# EAGLE schematic DrinkbotPCB (EAGLE 6.1)

## Sheet 1 of 2
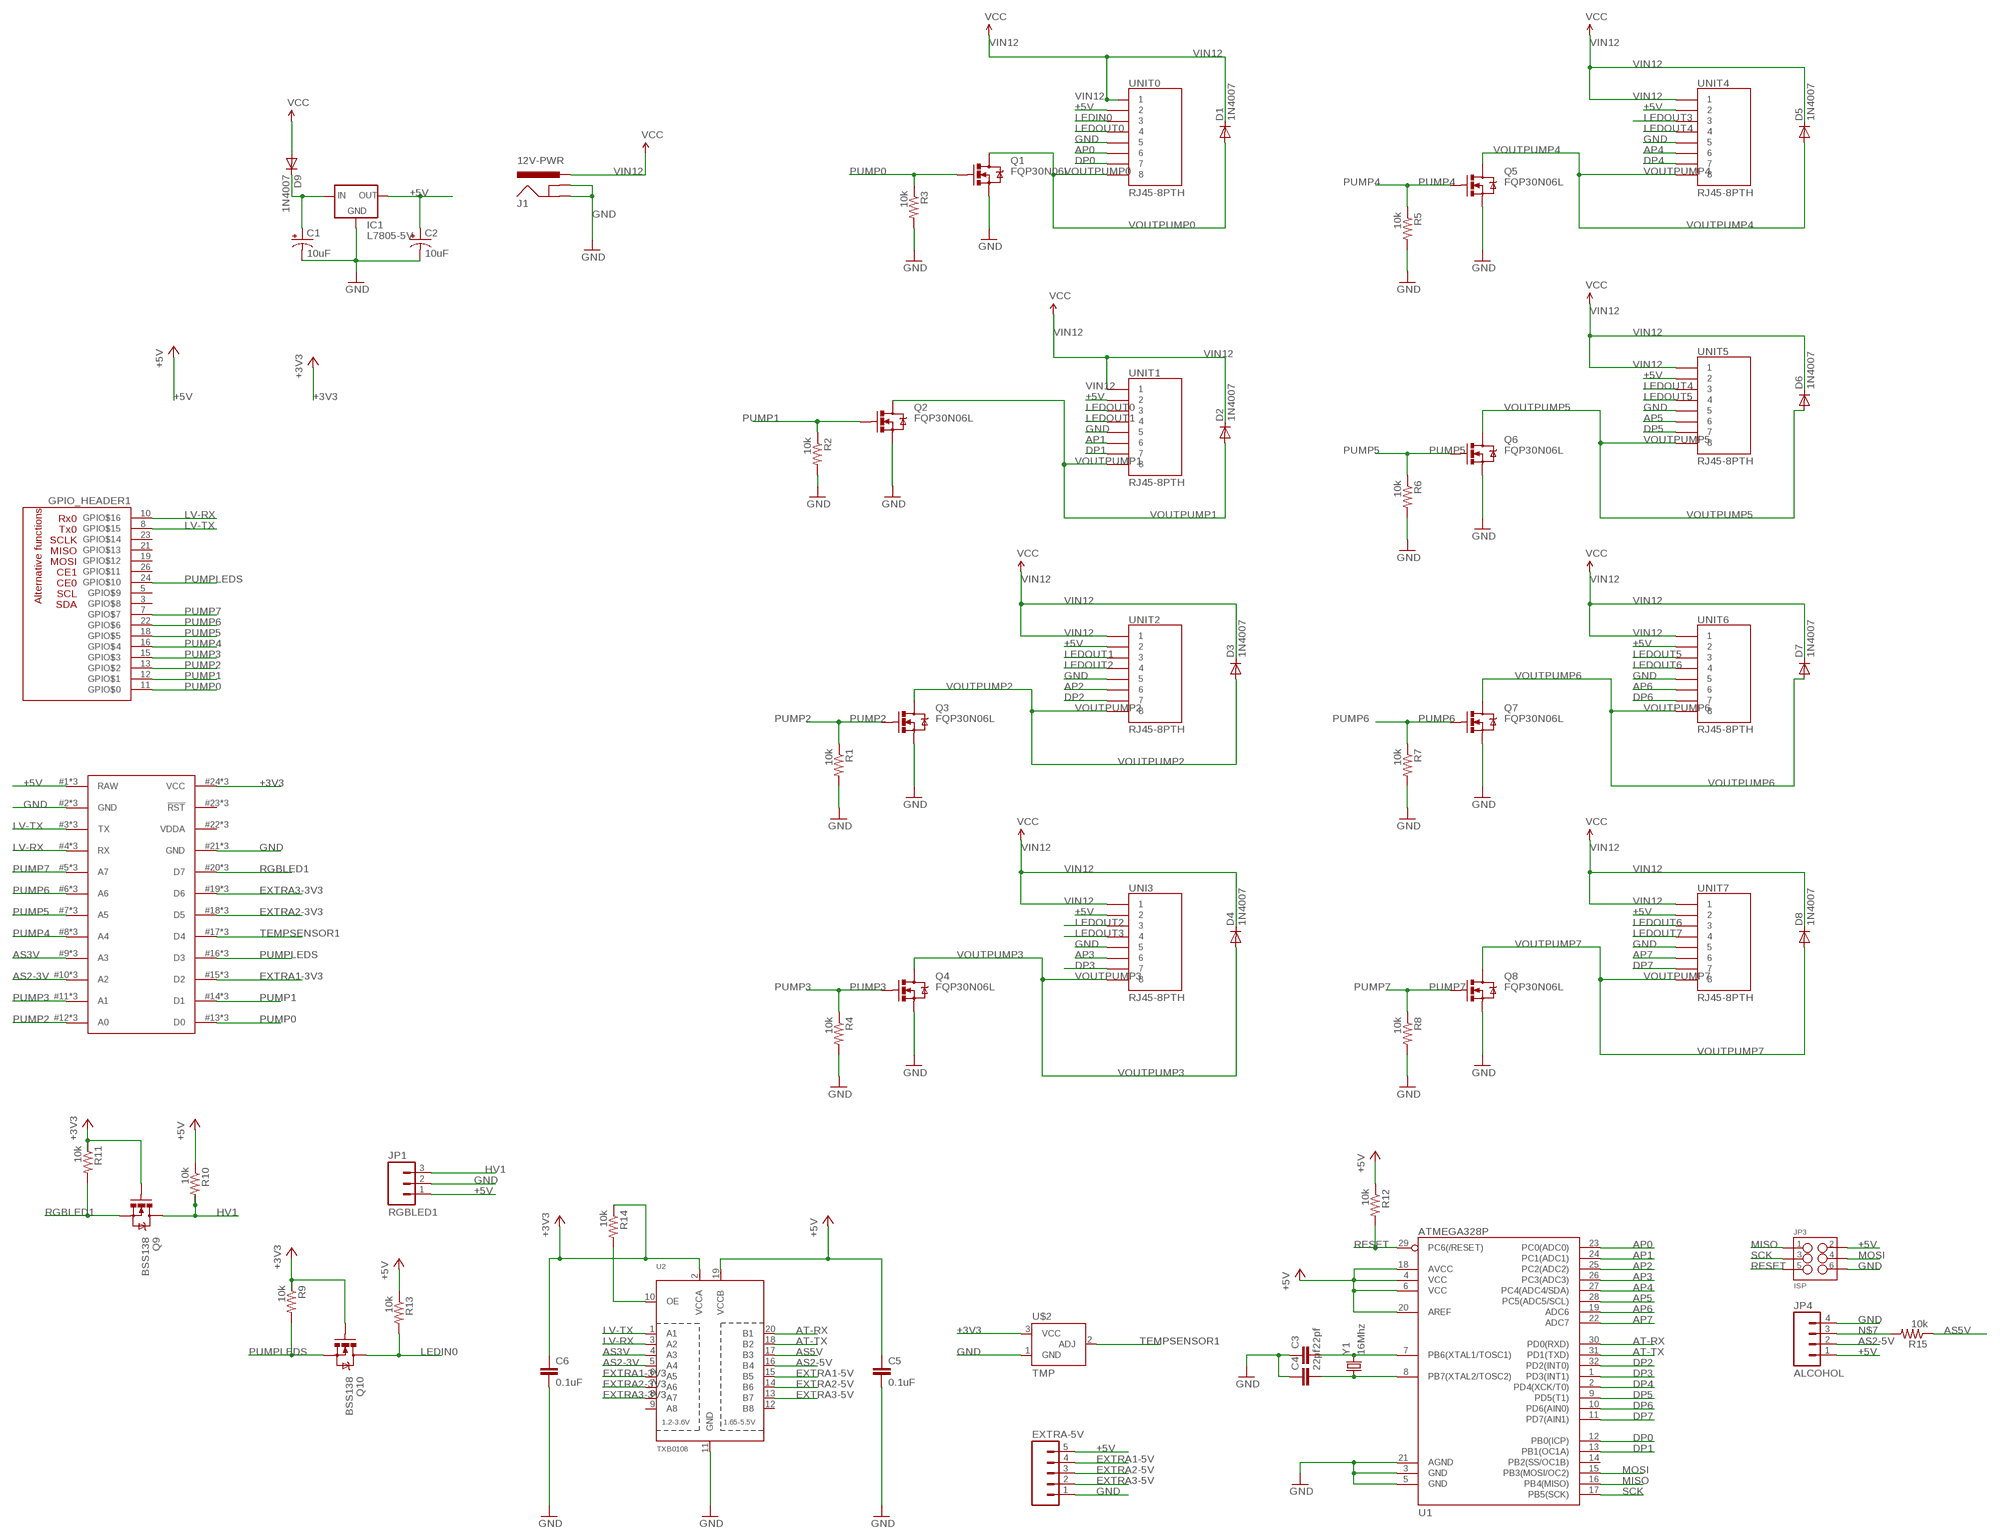
[diagram p0: schematic, sheet 1]

### Parts
C1  10uF  CAP_POLPTH2  [CPOL-RADIAL-10UF-25V]
C2  10uF  CAP_POLPTH2  [CPOL-RADIAL-10UF-25V]
C3  22pf  CAPKIT  [CAP-PTH-SMALL-KIT]
C4  22pf  CAPKIT  [CAP-PTH-SMALL-KIT]
C5  0.1uF  CAPKIT  [CAP-PTH-SMALL-KIT]
C6  0.1uF  CAPKIT  [CAP-PTH-SMALL-KIT]
D1  1N4007  DIODEPTH  [DIODE-1N4001]
D2  1N4007  DIODEPTH  [DIODE-1N4001]
D3  1N4007  DIODEPTH  [DIODE-1N4001]
D4  1N4007  DIODEPTH  [DIODE-1N4001]
D5  1N4007  DIODEPTH  [DIODE-1N4001]
D6  1N4007  DIODEPTH  [DIODE-1N4001]
D7  1N4007  DIODEPTH  [DIODE-1N4001]
D8  1N4007  DIODEPTH  [DIODE-1N4001]
D9  1N4007  DIODEPTH  [DIODE-1N4001]
EXTRA-5V  M05PTH  [1X05]
GPIO_HEADER1  RPI-GPIO  RPI_GPIO_HEADER  [2X13]
IC1  L7805-5V  V_REG_78XXSINK  [TO220-IGO]
J1  12V-PWR  POWER_JACKPTH  [POWER_JACK_PTH]
JP1  RGBLED1  M03JST-PTH  [JST-3-PTH]
JP3  ISP  M03X2  [2X3-SHROUDED]
JP4  ALCOHOL  M04PTH  [1X04]
Q1  FQP30N06L  MOSFET-NCHANNELFQP30N06L  [TO220V]
Q2  FQP30N06L  MOSFET-NCHANNELFQP30N06L  [TO220V]
Q3  FQP30N06L  MOSFET-NCHANNELFQP30N06L  [TO220V]
Q4  FQP30N06L  MOSFET-NCHANNELFQP30N06L  [TO220V]
Q5  FQP30N06L  MOSFET-NCHANNELFQP30N06L  [TO220V]
Q6  FQP30N06L  MOSFET-NCHANNELFQP30N06L  [TO220V]
Q7  FQP30N06L  MOSFET-NCHANNELFQP30N06L  [TO220V]
Q8  FQP30N06L  MOSFET-NCHANNELFQP30N06L  [TO220V]
Q9  BSS138  MOSFET-NCHANNELBSS138  [SOT23]
Q10  BSS138  MOSFET-NCHANNELBSS138  [SOT23]
R1  10k  RESISTORPTH-1/6W  [1/6W-RES]
R2  10k  RESISTORPTH-1/6W  [1/6W-RES]
R3  10k  RESISTORPTH-1/6W  [1/6W-RES]
R4  10k  RESISTORPTH-1/6W  [1/6W-RES]
R5  10k  RESISTORPTH-1/6W  [1/6W-RES]
R6  10k  RESISTORPTH-1/6W  [1/6W-RES]
R7  10k  RESISTORPTH-1/6W  [1/6W-RES]
R8  10k  RESISTORPTH-1/6W  [1/6W-RES]
R9  10k  RESISTORPTH-1/6W  [1/6W-RES]
R10  10k  RESISTORPTH-1/6W  [1/6W-RES]
R11  10k  RESISTORPTH-1/6W  [1/6W-RES]
R12  10k  RESISTORPTH-1/6W  [1/6W-RES]
R13  10k  RESISTORPTH-1/6W  [1/6W-RES]
R14  10k  RESISTORPTH-1/6W  [1/6W-RES]
R15  10k  RESISTORPTH-1/6W  [1/6W-RES]
U1  ATMEGA328P  ATMEGA328_SMT  [TQFP32-08]
U2  TXB0108  TXB0108PWR  [TSSOP20]
U$1  SPARK-CORE  SPARK_CORE  [SPARK_CORE_STACKABLE]
U$2  TMP  TEMPERATURE-SENSOR  [TO-92]
UNI3  RJ45-8PTH  [RJ45-8]
UNIT0  RJ45-8PTH  [RJ45-8]
UNIT1  RJ45-8PTH  [RJ45-8]
UNIT2  RJ45-8PTH  [RJ45-8]
UNIT4  RJ45-8PTH  [RJ45-8]
UNIT5  RJ45-8PTH  [RJ45-8]
UNIT6  RJ45-8PTH  [RJ45-8]
UNIT7  RJ45-8PTH  [RJ45-8]
Y1  16Mhz  CRYSTALHC49US  [HC49US]

### Nets
+3V3: C6.1 Q9.1(G) Q10.1(G) R9.1 R11.1 R14.1 U2.2(VCCA) U$1.24(VCC) U$1.#24(VCC) U$1.@24(VCC) U$2.3(VCC)
+5V: C2.1(+) C5.1 EXTRA-5V.5 IC1.OUT JP1.1 JP3.2 JP4.1 R10.1 R12.1 R13.1 U1.4(VCC) U1.6(VCC) U1.18(AVCC) U1.20(AREF) U2.19(VCCB) U$1.1(RAW) U$1.#1(RAW) U$1.@1(RAW) UNI3.2 UNIT0.2 UNIT1.2 UNIT2.2 UNIT4.2 UNIT5.2 UNIT6.2 UNIT7.2
AP0: U1.23(PC0(ADC0)) UNIT0.6
AP1: U1.24(PC1(ADC1)) UNIT1.6
AP2: U1.25(PC2(ADC2)) UNIT2.6
AP3: U1.26(PC3(ADC3)) UNI3.6
AP4: U1.27(PC4(ADC4/SDA)) UNIT4.6
AP5: U1.28(PC5(ADC5/SCL)) UNIT5.6
AP6: U1.19(ADC6) UNIT6.6
AP7: U1.22(ADC7) UNIT7.6
AS2-3V: U2.5(A4) U$1.10(A2) U$1.#10(A2) U$1.@10(A2)
AS2-5V: JP4.2 U2.16(B4)
AS3V: U2.4(A3) U$1.9(A3) U$1.#9(A3) U$1.@9(A3)
AS5V: R15.1 U2.17(B3)
AT-RX: U1.30(PD0(RXD)) U2.20(B1)
AT-TX: U1.31(PD1(TXD)) U2.18(B2)
DP0: U1.12(PB0(ICP)) UNIT0.7
DP1: U1.13(PB1(OC1A)) UNIT1.7
DP2: U1.32(PD2(INT0)) UNIT2.7
DP3: U1.1(PD3(INT1)) UNI3.7
DP4: U1.2(PD4(XCK/T0)) UNIT4.7
DP5: U1.9(PD5(T1)) UNIT5.7
DP6: U1.10(PD6(AIN0)) UNIT6.7
DP7: U1.11(PD7(AIN1)) UNIT7.7
EXTRA1-3V3: U2.6(A5) U$1.15(D2) U$1.#15(D2) U$1.@15(D2)
EXTRA1-5V: EXTRA-5V.4 U2.15(B5)
EXTRA2-3V3: U2.7(A6) U$1.18(D5) U$1.#18(D5) U$1.@18(D5)
EXTRA2-5V: EXTRA-5V.3 U2.14(B6)
EXTRA3-3V3: U2.8(A7) U$1.19(D6) U$1.#19(D6) U$1.@19(D6)
EXTRA3-5V: EXTRA-5V.2 U2.13(B7)
GND: C1.2(-) C2.2(-) C3.1 C4.1 C5.2 C6.2 EXTRA-5V.1 IC1.GND J1.GND J1.GNDBREAK JP1.2 JP3.6 JP4.4 Q1.3(S) Q2.3(S) Q3.3(S) Q4.3(S) Q5.3(S) Q6.3(S) Q7.3(S) Q8.3(S) R1.2 R2.2 R3.2 R4.2 R5.2 R6.2 R7.2 R8.2 U1.3(GND) U1.5(GND) U1.21(AGND) U2.11(GND) U$1.2(GND) U$1.21(GND) U$1.#2(GND) U$1.#21(GND) U$1.@2(GND) U$1.@21(GND) U$2.1(GND) UNI3.5 UNIT0.5 UNIT1.5 UNIT2.5 UNIT4.5 UNIT5.5 UNIT6.5 UNIT7.5
HV1: JP1.3 Q9.3(D) R10.2
LEDIN0: Q10.3(D) R13.2 UNIT0.3
LEDOUT0: UNIT0.4 UNIT1.3
LEDOUT1: UNIT1.4 UNIT2.3
LEDOUT2: UNI3.3 UNIT2.4
LEDOUT3: UNI3.4 UNIT4.3
LEDOUT4: UNIT4.4 UNIT5.3
LEDOUT5: UNIT5.4 UNIT6.3
LEDOUT6: UNIT6.4 UNIT7.3
LEDOUT7: UNIT7.4
LV-RX: GPIO_HEADER1.10(GPIO$16) U2.3(A2) U$1.4(RX) U$1.#4(RX) U$1.@4(RX)
LV-TX: GPIO_HEADER1.8(GPIO$15) U2.1(A1) U$1.3(TX) U$1.#3(TX) U$1.@3(TX)
MISO: JP3.1 U1.16(PB4(MISO))
MOSI: JP3.4 U1.15(PB3(MOSI/OC2))
N$1: C1.1(+) D9.C IC1.IN
N$2: C3.2 U1.7(PB6(XTAL1/TOSC1)) Y1.2
N$3: C4.2 U1.8(PB7(XTAL2/TOSC2)) Y1.1
N$5: R14.2 U2.10(OE)
N$7: JP4.3 R15.2
PUMP0: GPIO_HEADER1.11(GPIO$0) Q1.1(G) R3.1 U$1.13(D0) U$1.#13(D0) U$1.@13(D0)
PUMP1: GPIO_HEADER1.12(GPIO$1) Q2.1(G) R2.1 U$1.14(D1) U$1.#14(D1) U$1.@14(D1)
PUMP2: GPIO_HEADER1.13(GPIO$2) Q3.1(G) R1.1 U$1.12(A0) U$1.#12(A0) U$1.@12(A0)
PUMP3: GPIO_HEADER1.15(GPIO$3) Q4.1(G) R4.1 U$1.11(A1) U$1.#11(A1) U$1.@11(A1)
PUMP4: GPIO_HEADER1.16(GPIO$4) Q5.1(G) R5.1 U$1.8(A4) U$1.#8(A4) U$1.@8(A4)
PUMP5: GPIO_HEADER1.18(GPIO$5) Q6.1(G) R6.1 U$1.7(A5) U$1.#7(A5) U$1.@7(A5)
PUMP6: GPIO_HEADER1.22(GPIO$6) Q7.1(G) R7.1 U$1.6(A6) U$1.#6(A6) U$1.@6(A6)
PUMP7: GPIO_HEADER1.7(GPIO$7) Q8.1(G) R8.1 U$1.5(A7) U$1.#5(A7) U$1.@5(A7)
PUMPLEDS: GPIO_HEADER1.24(GPIO$10) Q10.2(S) R9.2 U$1.16(D3) U$1.#16(D3) U$1.@16(D3)
RESET: JP3.5 R12.2 U1.29(PC6(/RESET))
RGBLED1: Q9.2(S) R11.2 U$1.20(D7) U$1.#20(D7) U$1.@20(D7)
SCK: JP3.3 U1.17(PB5(SCK))
TEMPSENSOR1: U$1.17(D4) U$1.#17(D4) U$1.@17(D4) U$2.2(ADJ)
VIN12: D1.C D2.C D3.C D4.C D5.C D6.C D7.C D8.C D9.A J1.PWR UNI3.1 UNIT0.1 UNIT1.1 UNIT2.1 UNIT4.1 UNIT5.1 UNIT6.1 UNIT7.1 ; supply symbol labelled VCC
VOUTPUMP0: D1.A Q1.2(D) UNIT0.8
VOUTPUMP1: D2.A Q2.2(D) UNIT1.8
VOUTPUMP2: D3.A Q3.2(D) UNIT2.8
VOUTPUMP3: D4.A Q4.2(D) UNI3.8
VOUTPUMP4: D5.A Q5.2(D) UNIT4.8
VOUTPUMP5: D6.A Q6.2(D) UNIT5.8
VOUTPUMP6: D7.A Q7.2(D) UNIT6.8
VOUTPUMP7: D8.A Q8.2(D) UNIT7.8
Unconnected: GPIO_HEADER1.3(GPIO$8) GPIO_HEADER1.5(GPIO$9) GPIO_HEADER1.19(GPIO$12) GPIO_HEADER1.21(GPIO$13) GPIO_HEADER1.23(GPIO$14) GPIO_HEADER1.26(GPIO$11) U1.14(PB2(SS/OC1B)) U2.9(A8) U2.12(B8) U$1.23(!RST) U$1.#23(!RST) U$1.@23(!RST)

## Sheet 2 of 2

## Power pins joined to a net without a drawn wire
+3V3: GPIO_HEADER1.1(+3V3) GPIO_HEADER1.17(+3V3)
+5V: GPIO_HEADER1.2(+5V) GPIO_HEADER1.4(+5V)
GND: GPIO_HEADER1.6(GND) GPIO_HEADER1.9(GND) GPIO_HEADER1.14(GND) GPIO_HEADER1.20(GND) GPIO_HEADER1.25(GND)
VDDA: U$1.22(VDDA) U$1.#22(VDDA) U$1.@22(VDDA)

## Library data of the parts
C1 C2 = SparkFun-Passives:CAP_POL: Capacitor Polarized These are standard SMD and PTH capacitors. Normally 10uF, 47uF, and 100uF in electrolytic and tantalum varieties. Always verify the external diameter of the through hole cap, it varies with capacity, voltage, and manufacturer. The EIA devices should be standard.
C3-C6 = SparkFun-Capacitors:CAP: Capacitor Standard 0603 ceramic capacitor, and 0.1" leaded capacitor.
D1-D9 = SparkFun-DiscreteSemi:DIODE: Diode These are standard reverse protection diodes and small signal diodes. SMA package can handle up to about 1A. SOD-323 can handle about 200mA. What the SOD-323 package when ordering, there are some mfgs out there that are 5-pin packages.
EXTRA-5V = SparkFun-Connectors:M05: Header 5 Standard 5-pin 0.1" header. Use with straight break away headers (SKU : PRT-00116), right angle break away headers (PRT-00553), swiss pins (PRT-00743), machine pins (PRT-00117), and female headers (PRT-00115). Molex polarized connector foot print use with SKU : PRT-08230 with associated crimp pins and housings.
GPIO_HEADER1 = rpi-header:RPI_GPIO_HEADER: Raspberry PI GPIO Header (raspberry pi rev 2). Numbering is taken from WiringPi http://wiringpi.com/pins/ .
IC1 = SparkFun-PowerIC:V_REG_78XX: Voltage Regulator Standard 7805 5V regulator. IGO (Input Ground Output). Spark Fun Electronics SKU : COM-00107
J1 = SparkFun-Connectors:POWER_JACK: Power Jack This is the standard 5.5mm barrel jack for power. The PTH is the most common, proven, reliable, footprint. The Slot footprint only works if the mill layer is transmitted to the PCB fab house so be warned. Spark Fun Electronics SKU : PRT-00119 SMT: CONN-08106 Mating wall wart : TOL-00298 (and others)
JP1 = SparkFun-Connectors:M03: Header 3 Standard 3-pin 0.1" header. Use with straight break away headers (SKU : PRT-00116), right angle break away headers (PRT-00553), swiss pins (PRT-00743), machine pins (PRT-00117), and female headers (PRT-00115). Molex polarized connector foot print use with SKU : PRT-08232 with associated crimp pins and housings.
JP3 = SparkFun-Connectors:M03X2: 2x3 .1" header. Shrouded, with keying- CONN-10681 SMT- CONN-11415 Pogo pins- HW-11044; PROD_ID: CONN-10681
JP4 = SparkFun-Connectors:M04: Header 4 Standard 4-pin 0.1" header. Use with straight break away headers (SKU : PRT-00116), right angle break away headers (PRT-00553), swiss pins (PRT-00743), machine pins (PRT-00117), and female headers (PRT-00115). Molex polarized connector foot print use with SKU : PRT-08231 with associated crimp pins and housings. 1MM SMD Version SKU: PRT-10208
Q1-Q8 = SparkFun-DiscreteSemi:MOSFET-NCHANNEL: Common NMOSFET Parts MFG P/N Store ID Prod ID FDD8780 TRANS-09984 SI7820DN TRANS-11055 FDS6630A IC-08089 2N7002PW TRANS-11151 FQP30N06L COM-10213 TRANS-10060 BSS123LT1G TRANS-08345 BSS138 TRANS-00830 BS170 2N7000; PROD_ID: TRANS-10060
Q9 Q10 = SparkFun-DiscreteSemi:MOSFET-NCHANNEL: Common NMOSFET Parts MFG P/N Store ID Prod ID FDD8780 TRANS-09984 SI7820DN TRANS-11055 FDS6630A IC-08089 2N7002PW TRANS-11151 FQP30N06L COM-10213 TRANS-10060 BSS123LT1G TRANS-08345 BSS138 TRANS-00830 BS170 2N7000; PROD_ID: TRANS-00830
R1-R15 = SparkFun-Resistors:RESISTOR: Resistor Basic schematic elements and footprints for 0603, 1206, and PTH resistors.
U1 = SparkFun-DigitalIC:ATMEGA328_SMT: 32-Pin Atmega328 part Commonly used on Arduino compatible boards Available in QFP and QFN packages TQFP is IC-09069 QFN is non-stock; PROD_ID: IC-09069
U2 = adafruit:TXB0108PWR: 8-Bit Bi-Directional Level Shifter 1.2V-3.6V (VCCA) to 1.65V-5.5V (VCCB) bi-directional level shifter with auto direction sensing. Max data rate - VCCA 1.8V: 20Mbps (50ns), VCCA 3.3V: 100Mbps (10ns) Digikey: 296-21527-1-ND
U$1 = Spark:SPARK_CORE
U$2 = SparkFun-Sensors:TEMPERATURE-SENSOR: TO-92 temp sensor
UNI3 UNIT0 UNIT1 UNIT2 UNIT4-UNIT7 = SparkFun-Connectors:RJ45-8: RJ45 Jack Simple RJ45, 8-pin connection - connector for common Cat5, Cat5e, and Cat6 Ethernet cables. Footprint not yet proven in production. Connector sku is PRT-00643; Breakout PCB sku is BOB-00716.
Y1 = SparkFun-FreqCtrl:CRYSTAL: Various standard crystals. Proven footprints. Spark Fun Electronics SKU : COM-00534